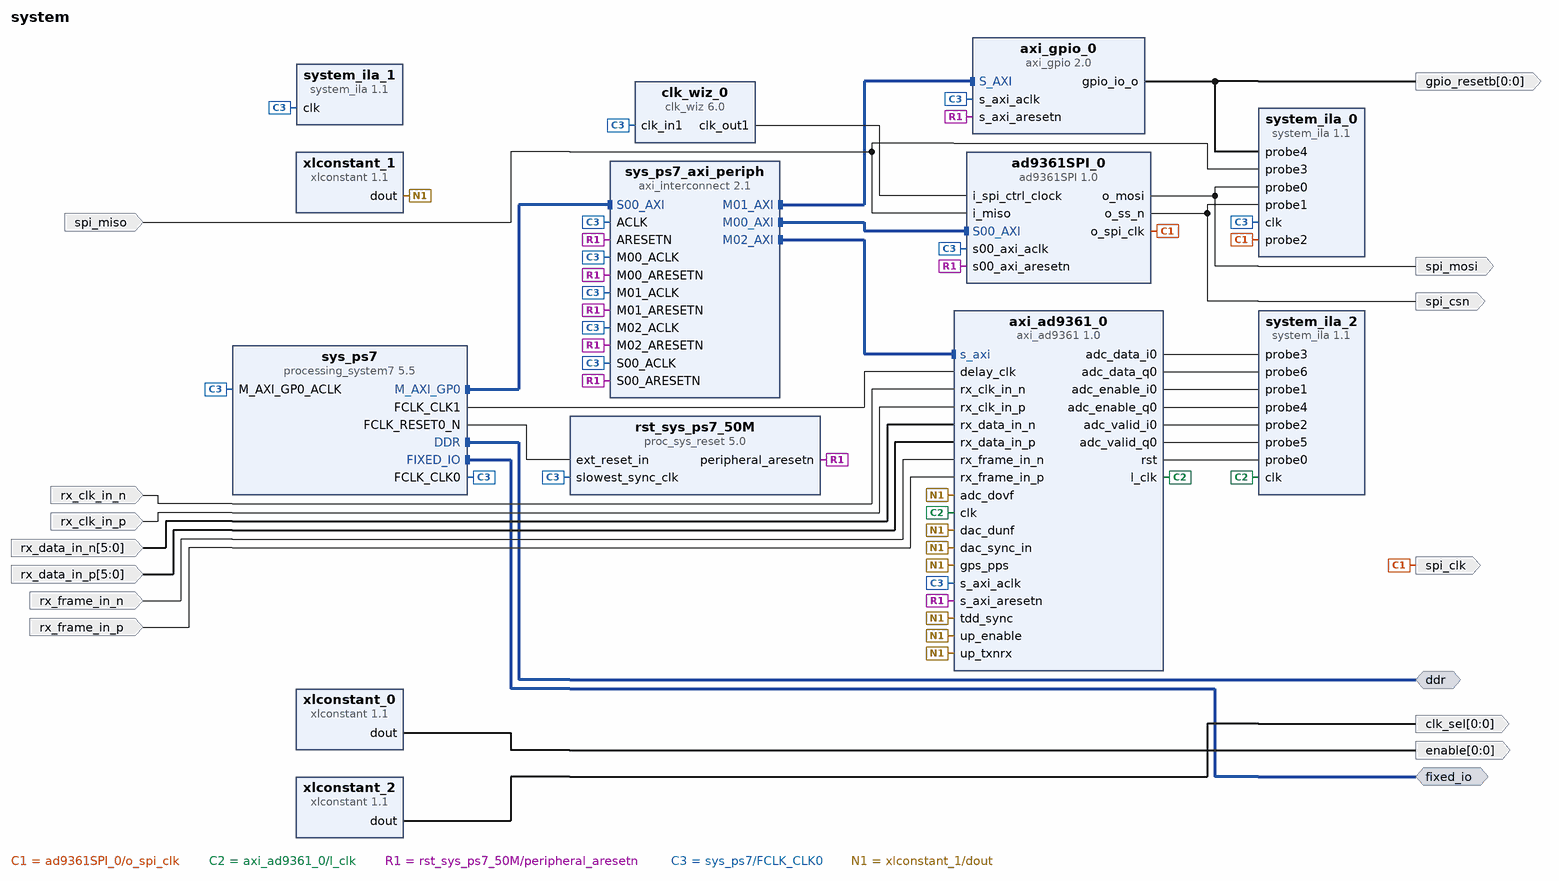
[diagram p0: block diagram of the top level]
# Vivado block design system, xc7z035ifbg676-2L, Vivado 2021.1
create_bd_design system

create_bd_intf_port -mode Master -vlnv xilinx.com:interface:ddrx_rtl:1.0 ddr
create_bd_intf_port -mode Master -vlnv xilinx.com:display_processing_system7:fixedio_rtl:1.0 fixed_io
create_bd_port -dir O spi_mosi
create_bd_port -dir O spi_csn
create_bd_port -dir O -type clk spi_clk
set_property -dict {CONFIG.FREQ_HZ 10000000} [get_bd_ports spi_clk]
create_bd_port -dir I spi_miso
create_bd_port -dir O -from 0 -to 0 gpio_resetb
create_bd_port -dir O -from 0 -to 0 enable
create_bd_port -dir O -from 0 -to 0 clk_sel
create_bd_port -dir I rx_clk_in_p
create_bd_port -dir I -from 5 -to 0 rx_data_in_p
create_bd_port -dir I rx_clk_in_n
create_bd_port -dir I rx_frame_in_p
create_bd_port -dir I rx_frame_in_n
create_bd_port -dir I -from 5 -to 0 rx_data_in_n

create_bd_cell -type ip -vlnv xilinx.com:ip:processing_system7:5.5 sys_ps7
set_property -dict [list \
  CONFIG.PCW_APU_PERIPHERAL_FREQMHZ 666.666666 \
  CONFIG.PCW_CPU_CPU_6X4X_MAX_RANGE 800 \
  CONFIG.PCW_ENET0_PERIPHERAL_ENABLE 0 \
  CONFIG.PCW_ENET1_PERIPHERAL_CLKSRC External \
  CONFIG.PCW_EN_CLK1_PORT 1 \
  CONFIG.PCW_FCLK_CLK1_BUF TRUE \
  CONFIG.PCW_FPGA0_PERIPHERAL_FREQMHZ 100 \
  CONFIG.PCW_FPGA1_PERIPHERAL_FREQMHZ 200.0 \
  CONFIG.PCW_FPGA2_PERIPHERAL_FREQMHZ 200.0 \
  CONFIG.PCW_FPGA_FCLK1_ENABLE 1 \
  CONFIG.PCW_GPIO_MIO_GPIO_ENABLE 0 \
  CONFIG.PCW_IRQ_F2P_INTR 1 \
  CONFIG.PCW_IRQ_F2P_MODE REVERSE \
  CONFIG.PCW_PERIPHERAL_BOARD_PRESET None \
  CONFIG.PCW_PRESET_BANK0_VOLTAGE {LVCMOS 1.8V} \
  CONFIG.PCW_PRESET_BANK1_VOLTAGE {LVCMOS 1.8V} \
  CONFIG.PCW_QSPI_PERIPHERAL_ENABLE 0 \
  CONFIG.PCW_SD0_PERIPHERAL_ENABLE 0 \
  CONFIG.PCW_UART1_PERIPHERAL_ENABLE 1 \
  CONFIG.PCW_UART1_UART1_IO {MIO 48 .. 49} \
  CONFIG.PCW_UART_PERIPHERAL_FREQMHZ 100 \
  CONFIG.PCW_UIPARAM_DDR_FREQ_MHZ 533.333333 \
  CONFIG.PCW_UIPARAM_DDR_PARTNO {MT41K256M16 RE-125} \
  CONFIG.PCW_USB0_PERIPHERAL_ENABLE 0 \
  CONFIG.PCW_USE_FABRIC_INTERRUPT 1 \
  CONFIG.preset None \
] [get_bd_cells sys_ps7]
# 342 more settings of sys_ps7 are not shown: defaults, MIO pin electricals, DDR timing, and values the tool derives
create_bd_cell -type ip -vlnv xilinx.com:ip:axi_interconnect:2.1 sys_ps7_axi_periph
set_property -dict {CONFIG.NUM_MI 3} [get_bd_cells sys_ps7_axi_periph]
create_bd_cell -type ip -vlnv xilinx.com:ip:proc_sys_reset:5.0 rst_sys_ps7_50M
create_bd_cell -type ip -vlnv xilinx.com:ip:clk_wiz:6.0 clk_wiz_0
set_property -dict [list \
  CONFIG.CLKIN1_JITTER_PS 100.0 \
  CONFIG.CLKOUT1_JITTER 290.478 \
  CONFIG.CLKOUT1_PHASE_ERROR 133.882 \
  CONFIG.CLKOUT1_REQUESTED_OUT_FREQ 10.000 \
  CONFIG.MMCM_CLKFBOUT_MULT_F 15.625 \
  CONFIG.MMCM_CLKIN1_PERIOD 10.000 \
  CONFIG.MMCM_CLKIN2_PERIOD 10.000 \
  CONFIG.MMCM_CLKOUT0_DIVIDE_F 78.125 \
  CONFIG.MMCM_DIVCLK_DIVIDE 2 \
  CONFIG.PRIM_IN_FREQ 100.000 \
  CONFIG.USE_LOCKED false \
  CONFIG.USE_RESET false \
] [get_bd_cells clk_wiz_0]
create_bd_cell -type ip -vlnv xilinx.com:ip:axi_gpio:2.0 axi_gpio_0
set_property -dict {CONFIG.C_ALL_OUTPUTS 1 CONFIG.C_DOUT_DEFAULT 0x00000001 CONFIG.C_GPIO_WIDTH 1} [get_bd_cells axi_gpio_0]
create_bd_cell -type ip -vlnv xilinx.com:ip:system_ila:1.1 system_ila_0
set_property -dict [list \
  CONFIG.C_DATA_DEPTH 8192 \
  CONFIG.C_MON_TYPE NATIVE \
  CONFIG.C_NUM_OF_PROBES 5 \
  CONFIG.C_PROBE0_TYPE 0 \
] [get_bd_cells system_ila_0]
create_bd_cell -type ip -vlnv xilinx.com:user:ad9361SPI:1.0 ad9361SPI_0
create_bd_cell -type ip -vlnv xilinx.com:ip:xlconstant:1.1 xlconstant_0
create_bd_cell -type ip -vlnv xilinx.com:ip:system_ila:1.1 system_ila_1
set_property -dict {CONFIG.C_DATA_DEPTH 8192 CONFIG.C_MON_TYPE NATIVE CONFIG.C_NUM_OF_PROBES 5} [get_bd_cells system_ila_1]
create_bd_cell -type ip -vlnv xilinx.com:ip:xlconstant:1.1 xlconstant_2
create_bd_cell -type ip -vlnv analog.com:user:axi_ad9361:1.0 axi_ad9361_0
set_property -dict [list \
  CONFIG.ADC_INIT_DELAY 29 \
  CONFIG.DAC_IODELAY_ENABLE 1 \
  CONFIG.DAC_USERPORTS_DISABLE 0 \
  CONFIG.DEV_PACKAGE 4 \
  CONFIG.FPGA_FAMILY 4 \
  CONFIG.FPGA_TECHNOLOGY 1 \
  CONFIG.MODE_1R1T 1 \
  CONFIG.PPS_RECEIVER_ENABLE 0 \
  CONFIG.SPEED_GRADE 21 \
  CONFIG.TDD_DISABLE 1 \
] [get_bd_cells axi_ad9361_0]
create_bd_cell -type ip -vlnv xilinx.com:ip:xlconstant:1.1 xlconstant_1
set_property -dict {CONFIG.CONST_VAL 0} [get_bd_cells xlconstant_1]
create_bd_cell -type ip -vlnv xilinx.com:ip:system_ila:1.1 system_ila_2
set_property -dict [list \
  CONFIG.C_DATA_DEPTH 8192 \
  CONFIG.C_MON_TYPE NATIVE \
  CONFIG.C_NUM_OF_PROBES 7 \
  CONFIG.C_PROBE0_TYPE 0 \
] [get_bd_cells system_ila_2]

# ---- connections ----

connect_bd_intf_net [get_bd_intf_ports ddr] [get_bd_intf_pins sys_ps7/DDR]
connect_bd_intf_net [get_bd_intf_ports fixed_io] [get_bd_intf_pins sys_ps7/FIXED_IO]
connect_bd_intf_net [get_bd_intf_pins sys_ps7/M_AXI_GP0] [get_bd_intf_pins sys_ps7_axi_periph/S00_AXI]
connect_bd_intf_net [get_bd_intf_pins sys_ps7_axi_periph/M00_AXI] [get_bd_intf_pins ad9361SPI_0/S00_AXI]
connect_bd_intf_net [get_bd_intf_pins sys_ps7_axi_periph/M01_AXI] [get_bd_intf_pins axi_gpio_0/S_AXI]
connect_bd_intf_net [get_bd_intf_pins sys_ps7_axi_periph/M02_AXI] [get_bd_intf_pins axi_ad9361_0/s_axi]
connect_bd_net -net ad9361SPI_0_o_mosi [get_bd_pins ad9361SPI_0/o_mosi] [get_bd_ports spi_mosi] [get_bd_pins system_ila_0/probe0]
connect_bd_net [get_bd_pins ad9361SPI_0/o_spi_clk] [get_bd_ports spi_clk] [get_bd_pins system_ila_0/probe2]
connect_bd_net [get_bd_pins ad9361SPI_0/o_ss_n] [get_bd_ports spi_csn] [get_bd_pins system_ila_0/probe1]
connect_bd_net [get_bd_pins axi_ad9361_0/adc_data_i0] [get_bd_pins system_ila_2/probe3]
connect_bd_net [get_bd_pins axi_ad9361_0/adc_data_q0] [get_bd_pins system_ila_2/probe6]
connect_bd_net [get_bd_pins axi_ad9361_0/adc_enable_i0] [get_bd_pins system_ila_2/probe1]
connect_bd_net [get_bd_pins axi_ad9361_0/adc_enable_q0] [get_bd_pins system_ila_2/probe4]
connect_bd_net [get_bd_pins axi_ad9361_0/adc_valid_i0] [get_bd_pins system_ila_2/probe2]
connect_bd_net [get_bd_pins axi_ad9361_0/adc_valid_q0] [get_bd_pins system_ila_2/probe5]
connect_bd_net [get_bd_pins axi_ad9361_0/l_clk] [get_bd_pins axi_ad9361_0/clk] [get_bd_pins system_ila_2/clk]
connect_bd_net [get_bd_pins axi_ad9361_0/rst] [get_bd_pins system_ila_2/probe0]
connect_bd_net [get_bd_pins axi_gpio_0/gpio_io_o] [get_bd_ports gpio_resetb] [get_bd_pins system_ila_0/probe4]
connect_bd_net [get_bd_pins clk_wiz_0/clk_out1] [get_bd_pins ad9361SPI_0/i_spi_ctrl_clock]
connect_bd_net -net i_miso_0_1 [get_bd_ports spi_miso] [get_bd_pins system_ila_0/probe3] [get_bd_pins ad9361SPI_0/i_miso]
connect_bd_net [get_bd_pins rst_sys_ps7_50M/peripheral_aresetn] \
  [get_bd_pins sys_ps7_axi_periph/S00_ARESETN] [get_bd_pins sys_ps7_axi_periph/M00_ARESETN] \
  [get_bd_pins sys_ps7_axi_periph/ARESETN] [get_bd_pins axi_gpio_0/s_axi_aresetn] \
  [get_bd_pins sys_ps7_axi_periph/M01_ARESETN] [get_bd_pins ad9361SPI_0/s00_axi_aresetn] \
  [get_bd_pins axi_ad9361_0/s_axi_aresetn] [get_bd_pins sys_ps7_axi_periph/M02_ARESETN]
connect_bd_net -net rx_clk_in_n_0_1 [get_bd_ports rx_clk_in_n] [get_bd_pins axi_ad9361_0/rx_clk_in_n]
connect_bd_net -net rx_clk_in_p_0_1 [get_bd_ports rx_clk_in_p] [get_bd_pins axi_ad9361_0/rx_clk_in_p]
connect_bd_net -net rx_data_in_n_0_1 [get_bd_ports rx_data_in_n] [get_bd_pins axi_ad9361_0/rx_data_in_n]
connect_bd_net -net rx_data_in_p_0_1 [get_bd_ports rx_data_in_p] [get_bd_pins axi_ad9361_0/rx_data_in_p]
connect_bd_net -net rx_frame_in_n_0_1 [get_bd_ports rx_frame_in_n] [get_bd_pins axi_ad9361_0/rx_frame_in_n]
connect_bd_net -net rx_frame_in_p_0_1 [get_bd_ports rx_frame_in_p] [get_bd_pins axi_ad9361_0/rx_frame_in_p]
connect_bd_net -net sys_cpu_clk [get_bd_pins sys_ps7/FCLK_CLK0] \
  [get_bd_pins sys_ps7/M_AXI_GP0_ACLK] [get_bd_pins sys_ps7_axi_periph/S00_ACLK] \
  [get_bd_pins rst_sys_ps7_50M/slowest_sync_clk] [get_bd_pins sys_ps7_axi_periph/M00_ACLK] \
  [get_bd_pins sys_ps7_axi_periph/ACLK] [get_bd_pins clk_wiz_0/clk_in1] [get_bd_pins axi_gpio_0/s_axi_aclk] \
  [get_bd_pins sys_ps7_axi_periph/M01_ACLK] [get_bd_pins system_ila_0/clk] [get_bd_pins ad9361SPI_0/s00_axi_aclk] \
  [get_bd_pins system_ila_1/clk] [get_bd_pins axi_ad9361_0/s_axi_aclk] [get_bd_pins sys_ps7_axi_periph/M02_ACLK]
connect_bd_net [get_bd_pins sys_ps7/FCLK_CLK1] [get_bd_pins axi_ad9361_0/delay_clk]
connect_bd_net [get_bd_pins sys_ps7/FCLK_RESET0_N] [get_bd_pins rst_sys_ps7_50M/ext_reset_in]
connect_bd_net [get_bd_pins xlconstant_0/dout] [get_bd_ports enable]
connect_bd_net [get_bd_pins xlconstant_1/dout] \
  [get_bd_pins axi_ad9361_0/adc_dovf] [get_bd_pins axi_ad9361_0/up_enable] [get_bd_pins axi_ad9361_0/up_txnrx] \
  [get_bd_pins axi_ad9361_0/dac_dunf] [get_bd_pins axi_ad9361_0/dac_sync_in] [get_bd_pins axi_ad9361_0/tdd_sync] \
  [get_bd_pins axi_ad9361_0/gps_pps]
connect_bd_net [get_bd_pins xlconstant_2/dout] [get_bd_ports clk_sel]
set_property HDL_ATTRIBUTE.DEBUG true [get_bd_nets ad9361SPI_0_o_mosi]
set_property HDL_ATTRIBUTE.MARK_DEBUG true [get_bd_nets ad9361SPI_0_o_mosi]

# ---- address map ----
assign_bd_address -offset 0x41200000 -range 64K -target_address_space [get_bd_addr_spaces sys_ps7/Data] [get_bd_addr_segs axi_gpio_0/S_AXI/Reg]
assign_bd_address -offset 0x43C00000 -range 64K -target_address_space [get_bd_addr_spaces sys_ps7/Data] [get_bd_addr_segs ad9361SPI_0/S00_AXI/S00_AXI_reg]
assign_bd_address -offset 0x43C10000 -range 64K -target_address_space [get_bd_addr_spaces sys_ps7/Data] [get_bd_addr_segs axi_ad9361_0/s_axi/axi_lite]

validate_bd_design
save_bd_design
